# Altium project Controler_Panou_Solar.PrjPcb
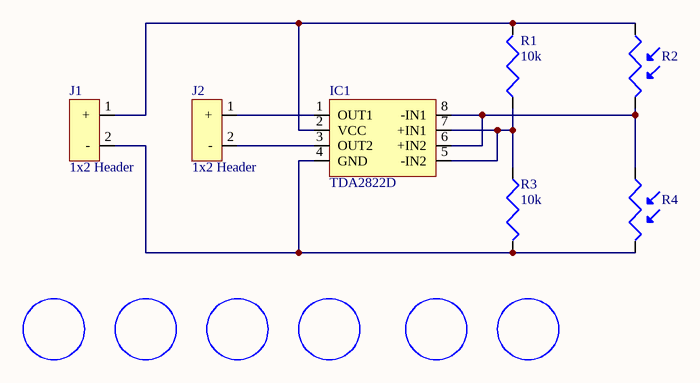
[diagram p0: CPS.SchDoc]
1 sheet, 13 parts. Net scope: global (net labels, ports and power ports of the same name join across sheets).
Board file: CPS.PcbDoc

## Sheet CPS.SchDoc
size A3; SheetNumber: 1; SheetTotal: 1

### Parts
H1  Hole  [Hole]  (value not drawn)
H2  Hole  [Hole]  (value not drawn)
H3  Hole  [Hole]  (value not drawn)
H4  Hole  [Hole]  (value not drawn)
H5  Hole  [Hole]  (value not drawn)
H6  Hole  [Hole]  (value not drawn)
IC1  TDA2822D  [TDA2822D]
J1  1x2 Header  [Conector]
J2  1x2 Header  [Conector]
R1  10k  [R0603]
R2  500k  [Photoresistor]  (value not drawn)
R3  10k  [R0603]
R4  500k  [Photoresistor]  (value not drawn)

### Nets
NetIC1_1: IC1.1(OUT1) J2.1(+)
NetIC1_2: IC1.2(VCC) J1.1(+) R1.2 R2.1
NetIC1_3: IC1.3(OUT2) J2.2(-)
NetIC1_4: IC1.4(GND) J1.2(-) R3.2 R4.2
NetIC1_5: IC1.5(-IN2) IC1.7(+IN1) R1.1 R3.1
NetIC1_6: IC1.6(+IN2) IC1.8(-IN1) R2.2 R4.1

### Library data of the parts
IC1 = TDA2822D: Audio Amp Headphone/Speaker 1-CH Mono/2-CH Stereo 1W Class-AB 8-Pin SO N Tube; Manufacturer: STMicroelectronics; Supplier 1: Mouser; Manufacturer Part Number: TDA2822D; RoHS: Yes; Category: Amplifiers - Audio; Stock 1: 17648; Pricing 1: 1=2.18, 10=1.96, 50=1.85, 100=1.56, 1000=1.08, 10000=0.961 (USD); ComponentLink1URL: https://datasheet.ciiva.com/15131/getdatasheetpartid-132869-15131661.pdf?src-supplier=Verical; ComponentLink1Description: https://datasheet.ciiva.com/15131/getdatasheetpartid-132869-15131661.pdf?src-supplier=Verical; ComponentLink2URL: https://datasheet.ciiva.com/1481/1449855-1481709.pdf?src-supplier=Element14; ComponentLink2Description: https://datasheet.ciiva.com/1481/1449855-1481709.pdf?src-supplier=Element14; ComponentLink3URL: https://datasheet.ciiva.com/1789/cd00000133-1789121.pdf?src-supplier=Digikey; ComponentLink3Description: https://datasheet.ciiva.com/1789/cd00000133-1789121.pdf?src-supplier=Digikey; Supplier Part Number 1: 511-TDA2822D
J1 J2 = 22-29-2021: KK 254 Wire-to-Board Header, Vertical, with Friction Lock, 2 Circuits, Gold (Au) Plating; Manufacturer: Molex; Plating: 154ConductorMaterial; Voltage Rating (DC): 250V; Supplier 1: Mouser; Manufacturer Part Number: 22-29-2021; RoHS: Yes; Category: Headers and Wire Housings; Stock 1: 18304; Pricing 1: 1=0.45, 10=0.357, 50=0.357, 100=0.297, 1000=0.257, 10000=0.206 (USD); Reach SVHC Compliant: 4187SVHC
R1 R3 = CRCW060310K0FKEA: SMD Chip Resistor, 10 kOhm, ± 1%, 100 mW, 0603 [1608 Metric], Thick Film, General Purpose; Manufacturer: Vishay; Resistance: 10kR; Power Rating: 100mW; Temperature Coefficient: 100ppm/°C; Voltage Rating: 75V; Supplier 1: Mouser; Manufacturer Part Number: CRCW060310K0FKEA; RoHS: Yes; Category: Chip SMD Resistors; Stock 1: 2811302; Pricing 1: 1=0.1, 10=0.017, 50=0.017, 100=0.01, 1000=0.008, 10000=0.004 (USD); Case/Package: 0603; Number of Pins: 2NUMBER; Case Code (Metric): 1608; Case Code (Imperial): 0603; Contact Plating: Tin; Size Code: 0603; Weight: 7.1E-05oz; Min Operating Temperature: -55°C; Max Operating Temperature: 155°C; Packaging: Tape and Reel; Tolerance: 1%; Termination: SMD/SMT; Series: CRCW; Max Power Dissipation: 100mW; Resistance Tolerance: 1%; Resistor Type: Thick Film; Number of Terminations: 2; Voltage Rating (DC): 75V; Features: Automotive AEC-Q200; Package Quantity: 10; Construction: Rectangular; Technology: THICK FILM; Length: 1.55mm; Width: 0.033inch; Height: 0.45mm; Depth: 0.85mm; Radiation Hardening: No; RoHS Compliant: Yes; Reach SVHC Compliant: Unknown; Lead Free: 5697LeadFree; Military Standard: Not; Supplier Part Number 1: 71-CRCW0603-10K-E3
R2 R4 = VT90N2: Ldr, 500 Kohm, 80MW, VT900 Series; Manufacturer: Excelitas; Supplier 1: Allied Electronics; Manufacturer Part Number: VT90N2; RoHS: No; ComponentLink1URL: https://datasheet.ciiva.com/1249/612931-1249375.pdf?src-supplier=Element14; ComponentLink1Description: https://datasheet.ciiva.com/1249/612931-1249375.pdf?src-supplier=Element14; Supplier Part Number 1: 70219703